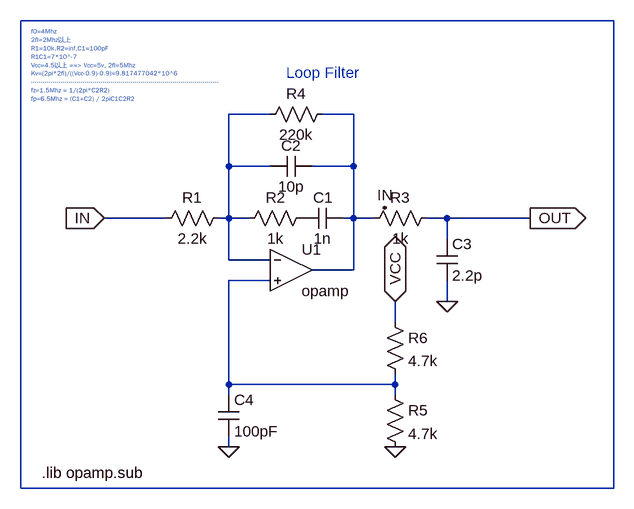
[diagram p0: schematic LoopFilter.asc]
LoopFilter.asc, the LTspice schematic file:
Version 4
SHEET 1 880 680
WIRE 752 -224 -160 -224
WIRE 224 -80 160 -80
WIRE 352 -80 304 -80
WIRE 160 0 160 -80
WIRE 224 0 160 0
WIRE 352 0 352 -80
WIRE 352 0 288 0
WIRE 64 80 -32 80
WIRE 160 80 160 0
WIRE 160 80 144 80
WIRE 192 80 160 80
WIRE 352 80 352 0
WIRE 352 80 336 80
WIRE 384 80 352 80
WIRE 496 80 464 80
WIRE 624 80 496 80
WIRE 496 112 496 80
WIRE 160 144 160 80
WIRE 224 144 160 144
WIRE 352 160 352 80
WIRE 352 160 288 160
WIRE 224 176 160 176
WIRE 496 208 496 176
WIRE 416 240 416 208
WIRE 160 336 160 176
WIRE 416 336 416 320
WIRE 416 336 160 336
WIRE 160 352 160 336
WIRE 416 352 416 336
WIRE 160 432 160 416
WIRE -160 496 -160 -224
WIRE 752 496 752 -224
WIRE 752 496 -160 496
FLAG 160 432 0
FLAG 496 208 0
FLAG 416 208 VCC
IOPIN 416 208 BiDir
FLAG 416 432 0
FLAG 400 64 IN
FLAG -32 80 IN
IOPIN -32 80 In
FLAG 624 80 OUT
IOPIN 624 80 Out
SYMBOL res 160 64 R90
WINDOW 0 0 56 VBottom 2
WINDOW 3 32 56 VTop 2
SYMATTR InstName R1
SYMATTR Value 2.2k
SYMBOL res 288 64 R90
WINDOW 0 0 56 VBottom 2
WINDOW 3 32 56 VTop 2
SYMATTR InstName R2
SYMATTR Value 1k
SYMBOL cap 272 64 M90
WINDOW 0 0 33 VBottom 2
WINDOW 3 32 32 VTop 2
SYMATTR InstName C1
SYMATTR Value 1n
SYMBOL cap 288 -16 R90
WINDOW 0 0 32 VBottom 2
WINDOW 3 32 32 VTop 2
SYMATTR InstName C2
SYMATTR Value 10p
SYMBOL cap 480 112 R0
SYMATTR InstName C3
SYMATTR Value 2.2p
SYMBOL res 480 64 R90
WINDOW 0 0 56 VBottom 2
WINDOW 3 32 56 VTop 2
SYMATTR InstName R3
SYMATTR Value 1k
SYMBOL res 320 -96 R90
WINDOW 0 0 56 VBottom 2
WINDOW 3 32 56 VTop 2
SYMATTR InstName R4
SYMATTR Value 220k
SYMBOL cap 144 352 R0
SYMATTR InstName C4
SYMATTR Value 100pF
SYMBOL res 400 336 R0
SYMATTR InstName R5
SYMATTR Value 4.7k
SYMBOL res 400 224 R0
SYMATTR InstName R6
SYMATTR Value 4.7k
SYMBOL Opamps\\opamp 256 96 R0
SYMATTR InstName U1
SYMATTR SpiceLine2 GBW=40Meg
TEXT 248 -144 Left 2 ;Loop Filter
TEXT -128 472 Left 2 !.lib opamp.sub
TEXT -144 -208 Left 0 ;f0=4Mhz\n2fl=2Mhz以上\nR1=10k,R2=inf,C1=100pF\nR1C1=7*10^-7\nVcc=4.5以上 ==> Vcc=5v, 2fl=5Mhz\nKv=(2pi*2fl)/((Vcc-0.9)-0.9)=9.817477042*10^6\n----------------------------------------------------------------------------------------------\nfz=1.5Mhz = 1/(2pi*C2R2)\nfp=6.5Mhz = (C1+C2) / 2piC1C2R2

The netlist it stands for:
* LoopFilter.asc
R1 N002 IN 2.2k
R2 P001 N002 1k
C1 P001 N003 1n
C2 N003 N002 10p
C3 OUT 0 2.2p
R3 OUT N003 1k
R4 N003 N002 220k
C4 N004 0 100pF
R5 N004 0 4.7k
R6 VCC N004 4.7k
XU1 N002 N004 N003 opamp Aol=100K GBW=40Meg  ; pins invin noninvin out
* Loop Filter
.lib opamp.sub
* f0=4Mhz
* 2fl=2Mhz以上
* R1=10k,R2=inf,C1=100pF
* R1C1=7*10^-7
* Vcc=4.5以上 ==> Vcc=5v, 2fl=5Mhz
* Kv=(2pi*2fl)/((Vcc-0.9)-0.9)=9.817477042*10^6
* ----------------------------------------------------------------------------------------------
* fz=1.5Mhz = 1/(2pi*C2R2)
* fp=6.5Mhz = (C1+C2) / 2piC1C2R2
.backanno
.end